# Altium schematic sheet SP26_FindingTitan_Polarization_Circuit_Mason_Lebens (2).SchDoc
size A; SheetNumber: 3; SheetTotal: 6
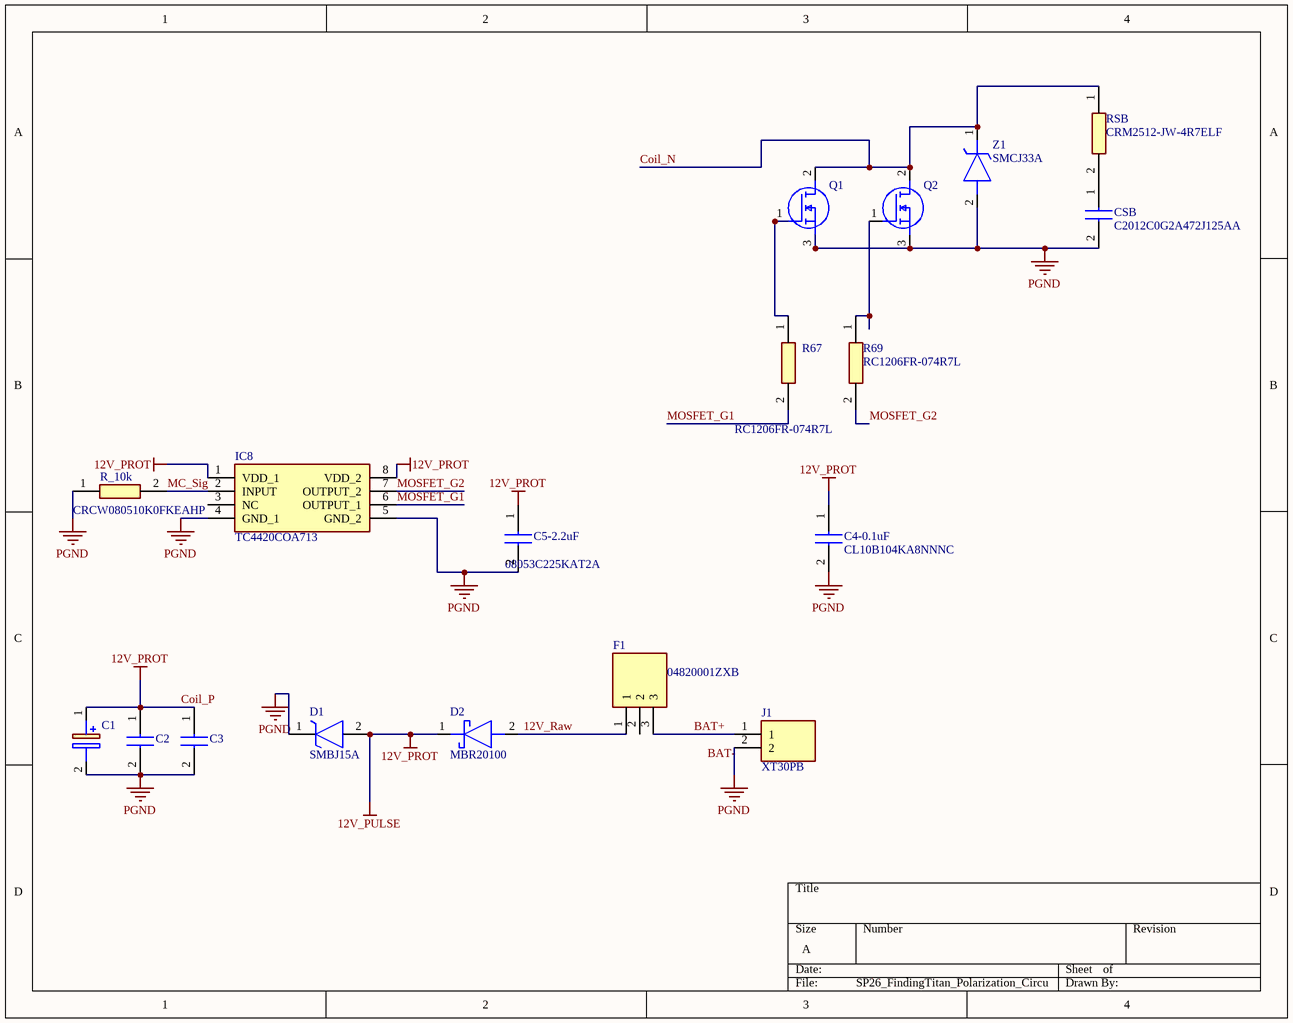
[diagram p0: SP26_FindingTitan_Polarization_Circuit_Mason_Lebens (2).SchDoc]

## Parts
C1  EEU-FR1V102  [CAPPRD500W65D1250H2200]  (value not drawn)
C2  GRM21BR71H105KA12L  [CAPC2012X145N]  (value not drawn)
C3  GRM21BR71H104KA01L  [CAPC2012X145N]  (value not drawn)
C4-0.1uF  CL10B104KA8NNNC  [CAPC1608X90N]
C5-2.2uF  08053C225KAT2A  [CAPC2012X152N]
CSB  C2012C0G2A472J125AA  [CAPC2012X145N]
D1  SMBJ15A  [DIOM5436X244N]
D2  MBR20100  [TO508P485X1018X1930-2P]
F1  04820001ZXB  [482-15A-PCB]
IC8  TC4420COA713  [SOIC127P600X175-8N]
J1  XT30PB  [XT30PB]
Q1  IPB017N10N5LFATMA1  [PG-TO263-7-3_3]  (value not drawn)
Q2  IPB017N10N5LFATMA1  [PG-TO263-7-3_3]  (value not drawn)
R67  RC1206FR-074R7L  [RESC3116X65N]
R69  RC1206FR-074R7L  [RESC3116X65N]
R_10k  CRCW080510K0FKEAHP  [RESC2012X60N]
RSB  CRM2512-JW-4R7ELF  [RESC6331X80N]
Z1  SMCJ33A  [DIOM7969X262N]

## Nets
Coil_P: C1.1(+) C2.1 C3.1 C4-0.1uF.1 C5-2.2uF.1 D1.2(A) D2.1(K) IC8.1(VDD_1) IC8.8(VDD_2)  [also labelled 12V_PROT, 12V_PULSE]
PGND: C1.2(-) C2.2 C3.2 C4-0.1uF.2 C5-2.2uF.2 CSB.2 D1.1(K) IC8.4(GND_1) IC8.5(GND_2) J1.2 Q1.3(S) Q2.3(S) R_10k.1 Z1.2(A)
12V_Raw: D2.2(A) F1.1
BAT+: F1.3 J1.1
Coil_N: Q1.2(D) Q2.2(D) RSB.1 Z1.1(K)
MC_Sig: IC8.2(INPUT) R_10k.2
MOSFET_G1: IC8.6(OUTPUT_1) R67.2
MOSFET_G2: IC8.7(OUTPUT_2) R69.2
NetCSB_1: CSB.1 RSB.2
NetQ1_1: Q1.1(G) R67.1
NetQ2_1: Q2.1(G) R69.1

Not connected (* = marked no-connect by the designer): F1 2; IC8 3(NC)

## Notes on the sheet
- Labels drawn without touching a wire or pin: BAT-

## Library data of the parts
C1 = EEU-FR1V102: Capacitor Polarised; Manufacturer_Name: Panasonic; Datasheet Link: http://industrial.panasonic.com/cdbs/www-data/pdf/RDF0000/ABA0000C1259.pdf; Height: 22mm; Manufacturer_Part_Number: EEU-FR1V102; Mouser Part Number: 667-EEU-FR1V102; Mouser Price/Stock: https://www.mouser.co.uk/ProductDetail/Panasonic/EEU-FR1V102?qs=Uw8ySfEHS7LpljZo28zysg%3D%3D; Arrow Part Number: EEU-FR1V102; Arrow Price/Stock: https://www.arrow.com/en/products/eeu-fr1v102/panasonic
C2 = GRM21BR71H105KA12L: Capacitor; Manufacturer_Name: Murata Electronics; Datasheet Link: https://search.murata.co.jp/Ceramy/image/img/A01X/G101/ENG/GRM21BR71H105KA12-01.pdf; Height: 1.45mm; Manufacturer_Part_Number: GRM21BR71H105KA12L; Mouser Part Number: 81-GRM21BR71H105KA2L; Mouser Price/Stock: https://www.mouser.co.uk/ProductDetail/Murata-Electronics/GRM21BR71H105KA12L?qs=Er06SXQpt%252B60EIT%2FJ7%2F41Q%3D%3D; Arrow Part Number: GRM21BR71H105KA12L; Arrow Price/Stock: https://www.arrow.com/en/products/grm21br71h105ka12l/murata-manufacturing?utm_currency=USD&region=europe
C3 = GRM21BR71H104KA01L: Capacitor; Manufacturer_Name: Murata Electronics; Datasheet Link: https://search.murata.co.jp/Ceramy/image/img/A01X/G101/ENG/GRM21BR71H104KA01-01.pdf; Height: 1.45mm; Manufacturer_Part_Number: GRM21BR71H104KA01L; Mouser Part Number: 81-GRM40X104K50L; Mouser Price/Stock: https://www.mouser.co.uk/ProductDetail/Murata-Electronics/GRM21BR71H104KA01L?qs=JovLnzPPZAL81o2XNDa%2FDA%3D%3D; Arrow Part Number: GRM21BR71H104KA01L; Arrow Price/Stock: https://www.arrow.com/en/products/grm21br71h104ka01l/murata-manufacturing?utm_currency=USD&region=europe
C4-0.1uF = CL10B104KA8NNNC: Capacitor; Manufacturer_Name: SAMSUNG; Datasheet Link: http://media.digikey.com/pdf/Data%20Sheets/Samsung%20PDFs/CL_Series_MLCC_ds.pdf; Height: 0.9mm; Manufacturer_Part_Number: CL10B104KA8NNNC; Mouser Part Number: 187-CL10B104KA8NNNC; Mouser Price/Stock: https://www.mouser.co.uk/ProductDetail/Samsung-Electro-Mechanics/CL10B104KA8NNNC?qs=349EhDEZ59rmu3pGeZXx0A%3D%3D; Arrow Part Number: CL10B104KA8NNNC; Arrow Price/Stock: https://www.arrow.com/en/products/cl10b104ka8nnnc/samsung-electro-mechanics?utm_currency=USD&region=europe
C5-2.2uF = 08053C225KAT2A: Capacitor; Manufacturer_Name: Kyocera AVX; Datasheet Link: https://datasheet.datasheetarchive.com/originals/distributors/Datasheets-DGA10/2418872.pdf; Height: 1.52mm; Manufacturer_Part_Number: 08053C225KAT2A; Mouser Part Number: 581-08053C225K; Mouser Price/Stock: https://www.mouser.co.uk/ProductDetail/KYOCERA-AVX/08053C225KAT2A?qs=NlNVDDZd7xSL5kNgCOchrA%3D%3D; Arrow Part Number: 08053C225KAT2A; Arrow Price/Stock: https://www.arrow.com/en/products/08053c225kat2a/avx
CSB = C2012C0G2A472J125AA: Capacitor; Manufacturer_Name: TDK; Datasheet Link: https://product.tdk.com/info/en/catalog/datasheets/mlcc_commercial_midvoltage_en.pdf; Height: 1.45mm; Manufacturer_Part_Number: C2012C0G2A472J125AA; Mouser Part Number: 810-C2012C0G2A472J; Mouser Price/Stock: https://www.mouser.co.uk/ProductDetail/TDK/C2012C0G2A472J125AA?qs=NRhsANhppD%252Bumxfv0IUAjg%3D%3D; Arrow Part Number: C2012C0G2A472J125AA; Arrow Price/Stock: https://www.arrow.com/en/products/c2012c0g2a472j125aa/tdk?utm_currency=USD&region=nac
D1 = SMBJ15A: TVS Diode (Uni-directional); Manufacturer_Name: Vishay; Datasheet Link: http://www.vishay.com/docs/88392/smbj.pdf; Height: 2.44mm; Manufacturer_Part_Number: SMBJ15A; Mouser Part Number: 78-SMBJ15A; Mouser Price/Stock: https://www.mouser.co.uk/ProductDetail/Vishay-General-Semiconductor/SMBJ15A?qs=%252BA9HMDDz5KavBY56EO7ceQ%3D%3D
D2 = MBR20100: Schottky Diode; Manufacturer_Name: SMC Diode Solutions; Datasheet Link: http://www.smc-diodes.com/propdf/MBR20100%20N0759%20REV.B.pdf; Height: 4.85mm; Manufacturer_Part_Number: MBR20100
F1 = 04820001ZXB: Fuse; Manufacturer_Name: LITTELFUSE; Datasheet Link: http://www.littelfuse.com/~/media/electronics/datasheets/fuses/littelfuse_fuse_482_datasheet.pdf.pdf; Manufacturer_Part_Number: 04820001ZXB; Mouser Part Number: 576-04820001ZXB; Mouser Price/Stock: https://www.mouser.com/Search/Refine.aspx?Keyword=576-04820001ZXB; Arrow Part Number: 04820001ZXB; Arrow Price/Stock: https://www.arrow.com/en/products/04820001zxb/littelfuse
IC8 = TC4420COA713: Integrated Circuit; Manufacturer_Name: Microchip; Datasheet Link: https://www.mouser.de/datasheet/2/268/21419D-3441717.pdf; Height: 1.75mm; Manufacturer_Part_Number: TC4420COA713; Mouser Part Number: 579-TC4420COA713; Mouser Price/Stock: https://www.mouser.co.uk/ProductDetail/Microchip-Technology/TC4420COA713?qs=KwArPi4cUohqVwIUJ%2FLcSA%3D%3D; Arrow Part Number: TC4420COA713; Arrow Price/Stock: https://www.arrow.com/en/products/tc4420coa713/microchip-technology?utm_currency=USD&region=nac
J1 = XT30PB: Connector; Manufacturer_Name: Amass; Datasheet Link: https://www.tme.eu/Document/4acc913878197f8c2e30d4b8cdc47230/XT30UPB%20SPEC.pdf; Height: 10.7mm; Manufacturer_Part_Number: XT30PB
Q1 Q2 = IPB020N10N5LFATMA1: MOSFET (N-Channel); Manufacturer_Name: Infineon; Datasheet Link: https://www.infineon.com/dgdl/Infineon-IPB020N10N5LF-DS-v02_01-EN.pdf?fileId=5546d46259d9a4bf015a5b253d4c3c67; Height: 4.82mm; Manufacturer_Part_Number: IPB020N10N5LFATMA1; Mouser Part Number: 726-IPB020N10N5LFATM; Mouser Price/Stock: https://www.mouser.co.uk/ProductDetail/Infineon-Technologies/IPB020N10N5LFATMA1?qs=u4fy%2FsgLU9MbVfrU1hsYag%3D%3D; Arrow Part Number: IPB020N10N5LFATMA1; Arrow Price/Stock: https://www.arrow.com/en/products/ipb020n10n5lfatma1/infineon-technologies-ag?utm_currency=USD&region=nac
R67 R69 = RC1206FR-074R7L: Resistor; Manufacturer_Name: YAGEO; Datasheet Link: https://www.sos.sk/productdata/35/10/4/35104/RC1206.pdf; Height: 0.65mm; Manufacturer_Part_Number: RC1206FR-074R7L; Mouser Part Number: 603-RC1206FR-074R7L; Mouser Price/Stock: https://www.mouser.com/Search/Refine.aspx?Keyword=603-RC1206FR-074R7L; Arrow Part Number: RC1206FR-074R7L; Arrow Price/Stock: https://www.arrow.com/en/products/rc1206fr-074r7l/yageo
R_10k = CRCW080510K0FKEAHP: Resistor; Manufacturer_Name: Vishay; Datasheet Link: https://componentsearchengine.com/Datasheets/1/CRCW08051R00FKEAHP.pdf; Height: 0.6mm; Manufacturer_Part_Number: CRCW080510K0FKEAHP; Mouser Part Number: 71-CRCW080510K0FKEAH; Mouser Price/Stock: https://www.mouser.co.uk/ProductDetail/Vishay-Dale/CRCW080510K0FKEAHP?qs=FlFvgi4rxBybVOW6oiRQjA%3D%3D; Arrow Part Number: CRCW080510K0FKEAHP; Arrow Price/Stock: https://www.arrow.com/en/products/crcw080510k0fkeahp/vishay.html?utm_currency=USD&region=europe
RSB = CRM2512-JW-4R7ELF: Resistor; Manufacturer_Name: Bourns; Datasheet Link: http://www.bourns.com/data/global/pdfs/CRM0805_1206_2010.pdf; Height: 0.8mm; Manufacturer_Part_Number: CRM2512-JW-4R7ELF; Mouser Part Number: 652-CRM2512JW4R7ELF; Mouser Price/Stock: https://www.mouser.co.uk/ProductDetail/Bourns/CRM2512-JW-4R7ELF?qs=%2FxQVPCMPNzhuvoImpXatPQ%3D%3D; Arrow Part Number: CRM2512-JW-4R7ELF; Arrow Price/Stock: https://www.arrow.com/en/products/crm2512-jw-4r7elf/bourns
Z1 = SMCJ33A: Zener Diode; Manufacturer_Name: LITTELFUSE; Datasheet Link: http://www.littelfuse.com/~/media/electronics/datasheets/tvs_diodes/littelfuse_tvs_diode_smcj_datasheet.pdf.pdf; Height: 2.62mm; Manufacturer_Part_Number: SMCJ33A; Mouser Part Number: 576-SMCJ33A; Mouser Price/Stock: https://www.mouser.co.uk/ProductDetail/Littelfuse/SMCJ33A?qs=JJML70Qc14uOizgItquj%2Fw%3D%3D; Arrow Part Number: SMCJ33A; Arrow Price/Stock: https://www.arrow.com/en/products/smcj33a/littelfuse?utm_currency=USD&region=europe